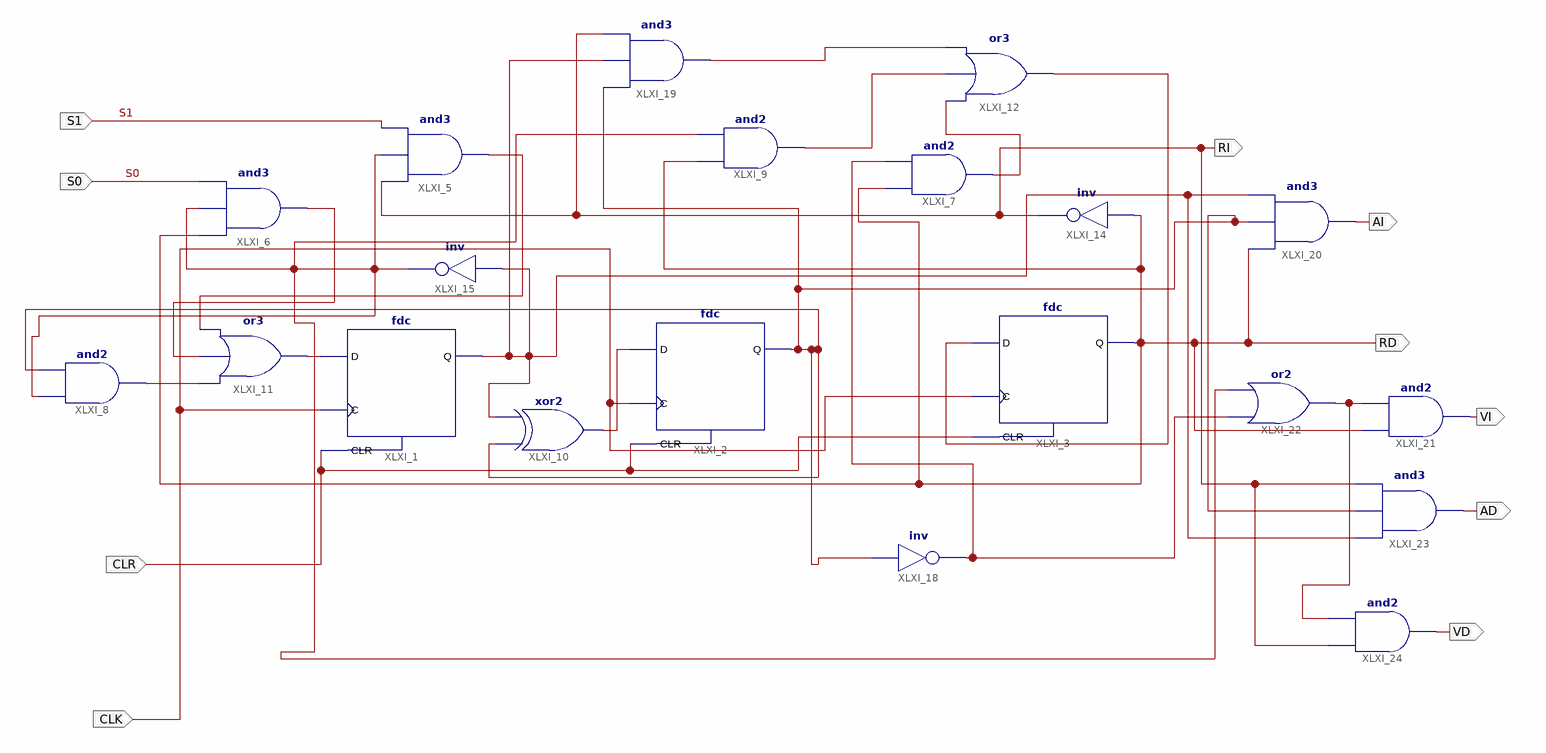
[diagram p0: schematic sheet 1]
// Xilinx ISE schematic p4ej1.sch (spartan3) as structural Verilog: 20 symbols, 11 ports
module p4ej1 (
  input  S1,
  input  S0,
  input  CLR,
  input  CLK,
  output XLXN_21,
  output RI,
  output AI,
  output VI,
  output RD,
  output AD,
  output VD
);

  wire XLXN_3, XLXN_5, XLXN_14, XLXN_17, XLXN_18, XLXN_24, XLXN_32, XLXN_35, XLXN_36, XLXN_37, XLXN_38,
       XLXN_45, XLXN_52, XLXN_55;

  fdc XLXI_1 (.C(CLK), .CLR(CLR), .D(XLXN_3), .Q(XLXN_52));
  fdc XLXI_2 (.C(CLK), .CLR(CLR), .D(XLXN_18), .Q(XLXN_32));
  fdc XLXI_3 (.C(CLK), .CLR(CLR), .D(XLXN_38), .Q(RD));
  and XLXI_5 (XLXN_5, RI, XLXN_45, S1);
  and XLXI_6 (XLXN_14, RD, XLXN_45, S0);
  and XLXI_7 (XLXN_37, RD, XLXN_24);
  and XLXI_8 (XLXN_17, XLXN_45, XLXN_32);
  and XLXI_9 (XLXN_36, RD, XLXN_45);
  xor XLXI_10 (XLXN_18, XLXN_32, XLXN_52);
  or XLXI_11 (XLXN_3, XLXN_17, XLXN_14, XLXN_5);
  or XLXI_12 (XLXN_38, XLXN_37, XLXN_36, XLXN_35);
  not XLXI_14 (RI, RD);
  not XLXI_15 (XLXN_45, XLXN_52);
  not XLXI_18 (XLXN_24, XLXN_32);
  and XLXI_19 (XLXN_35, XLXN_32, XLXN_52, RI);
  and XLXI_20 (AI, RD, XLXN_32, XLXN_52);
  and XLXI_21 (VI, RD, XLXN_55);
  or XLXI_22 (XLXN_55, XLXN_24, XLXN_45);
  and XLXI_23 (AD, XLXN_52, XLXN_32, RI);
  and XLXI_24 (VD, RI, XLXN_55);
endmodule
